# Altium schematic sheet Charging.SchDoc
size A; SheetNumber: 6
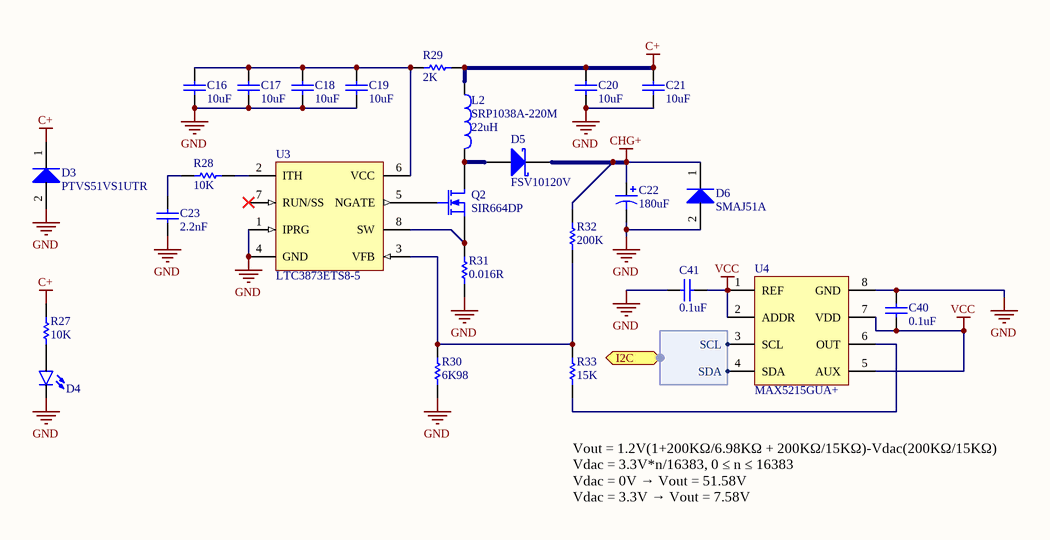
[diagram p0: Charging.SchDoc]

## Parts
C16  value 10uF  [C0603[1608X92]]  (hidden comment: 10uF 35V 0603)
C17  value 10uF  [C0603[1608X92]]  (hidden comment: 10uF 35V 0603)
C18  value 10uF  [C0603[1608X92]]  (hidden comment: 10uF 35V 0603)
C19  value 10uF  [C0603[1608X92]]  (hidden comment: 10uF 35V 0603)
C20  value 10uF  [C1206[3216X160]]  (hidden comment: 10uF 50V 1206)
C21  value 10uF  [C1206[3216X160]]  (hidden comment: 10uF 50V 1206)
C22  value 180uF  [CAP-ELECTROLYTIC[10.0x12.6]]  (hidden comment: 180uF 50V)
C23  value 2.2nF  [C0402[1005X55]]  (hidden comment: 2.2nF 50V 0402)
C40  value 0.1uF  [C0402[1005X55]]  (hidden comment: 0.1uF 6.3V 0402)
C41  value 0.1uF  [C0402[1005X55]]  (hidden comment: 0.1uF 6.3V 0402)
D3  PTVS51VS1UTR  [SOD-123W]
D4  LED_0603_GREEN_5mA  [LED0603]  (value not drawn)
D5  FSV10120V  [TO-277]
D6  SMAJ51A  [DO-214AC]
L2  SRP1038A-220M  value 22uH  [SRP1038A]
Q2  SIR664DP  [PowerPak-8]
R27  value 10K  [R0603[1608]]  (hidden comment: 10K 1% 0603)
R28  value 10K  [R0402[1005]]  (hidden comment: 10K 1% 0402)
R29  value 2K  [R0603[1608]]  (hidden comment: 2K 2% 0603)
R30  value 6K98  [R0402[1005]]  (hidden comment: 6K98 1% 0402)
R31  value 0.016R  [R1206[3216]]  (hidden comment: 0.016R 1% 1206)
R32  value 200K  [R0402[1005]]  (hidden comment: 200K 1% 0402)
R33  value 15K  [R0402[1005]]  (hidden comment: 15K 1% 0402)
U3  LTC3873ETS8-5  [SOT-23-8]
U4  MAX5215GUA+  [MSOP-8]

## Ports
I2C (harness I2C)

## Harnesses
I2C: SCL, SDA

## Nets
C+: C20.2 C21.2 D3.1(K) L2.1 R27.2 R29.2
CHG+: C22.1 D5.1(K) D6.1(K) R32.2
GND: C16.1 C17.1 C18.1 C19.1 C20.1 C21.1 C22.2 C23.1 C40.1 C41.1 D3.2(A) D4.C D6.2(A) R30.1 R31.1 U3.1(IPRG) U3.4(GND) U4.8(GND)
VCC: C40.2 C41.2 U4.1(REF) U4.2(ADDR) U4.5(AUX) U4.7(VDD)
NetC16_2: C16.2 C17.2 C18.2 C19.2 R29.1 U3.6(VCC)
NetC23_2: C23.2 R28.2
NetD4_A: D4.A R27.1
NetD5_2: D5.2(A) L2.2 Q2.3(D)
NetQ2_1: Q2.1(S) R31.2 U3.8(SW)
NetQ2_2: Q2.2(G) U3.5(NGATE)
NetR28_1: R28.1 U3.2(ITH)
NetR30_2: R30.2 R32.1 R33.2 U3.3(VFB)
NetR33_1: R33.1 U4.6(OUT)
NetU4_3: U4.3(SCL) ; port I2C.SCL
NetU4_4: U4.4(SDA) ; port I2C.SDA

Not connected (* = marked no-connect by the designer): U3 7(RUN/SS)*

## Notes on the sheet
- Vout = 1.2V(1+200KΩ/6.98KΩ + 200KΩ/15KΩ)-Vdac(200KΩ/15KΩ)
  Vdac = 3.3V*n/16383, 0 ≤ n ≤ 16383
  Vdac = 0V → Vout = 51.58V
  Vdac = 3.3V → Vout = 7.58V

## Library data of the parts
C16-C19 = CAP_10uF_35V_0603_10%: 10uF 35V 10% 0603 (1608 Metric); PartNumber: GRM188R6YA106MA73D; Manufacturer: Murata; Mounting Technology: Surface Mount; PackageReference: 0603; PackageDescription: 0603 (1608 Metric); Voltage: 35V; Tolerance: 10%
C20 C21 = CAP_10uF_50V_1206_20%: 10uF 50V 20% 1206 (3216 Metric); PartNumber: UMK316BBJ106ML-T; Manufacturer: Taiyo Yuden; Tolerance: 20%; Mounting Technology: Surface Mount; PackageReference: 1206; PackageDescription: 1206 (3216 Metric); Voltage: 50V
C22 = CAP_180uF_50V_20%: 180uF 50V 20%; PartNumber: PCR1H181MCL1GS; Manufacturer: Nichicon; PackageReference: 1H; PackageDescription: 10x12.7mm; Mounting Technology: Surface Mount; Voltage: 50V; Tolerance: 20%
C23 = CAP_2.2nF_50V_0402_10%: 2.2nF 50V 10% 0402 (1005 Metric); PartNumber: GCM155R71H222KA37D; Manufacturer: Murata; Tolerance: 10%; Mounting Technology: Surface Mount; PackageReference: 0402; PackageDescription: 0402 (1005 Metric); Voltage: 50V
C40 C41 = CAP_0.1uF_6.3V_0402_10%: 0.1uF 6.3V 10% 0402 (1005 Metric); PartNumber: GRM155R70J104KA01D; Manufacturer: Murata; Mounting Technology: Surface Mount; PackageReference: 0402; PackageDescription: 0402 (1005 Metric); Voltage: 6.3V; Tolerance: 10%
D3 = PTVS51VS1UTR,115: Manufacturer: NXP; Mounting Technology: Surface Mount; PartNumber: PTVS51VS1UTR,115; PackageReference: SOD-123W; PackageDescription: SOD123W, 2-Leads
D4 = LED_0603_GREEN_5mA: PartNumber: LTST-C193TGKT-5A; Manufacturer: Lite-On Inc.; PackageReference: 0603; PackageDescription: 0603 (1608 Metric); Mounting Technology: Surface Mount
D5 = FSV10120V: Schottky Diodes & Rectifiers 10 Amp 120V Schottky Rectifier; Manufacturer: Fairchild Semiconductor; PackageReference: TO-277-3; PartNumber: FSV10120V; Mounting Technology: Surface Mount
D6 = SMAJ51A-E3/61: Manufacturer: Vishay; PartNumber: SMAJ51A-E3/61; PackageReference: DO-214AC; PackageDescription: DO-214AC, 2 Leads; Mounting Technology: Surface Mount
L2 = SRP1038A-220M: 22uH 20% 7A 1038; Manufacturer: Bourns; PackageReference: SRP1038A; PartNumber: SRP1038A-220M; Mounting Technology: Surface Mount
Q2 = SIR664DP-T1-GE3: N-Channel MOSFET; Manufacturer: Vishay; PartNumber: SIR664DP-T1-GE3; Mounting Technology: Surface Mount; PackageReference: PowerPAK-8
R27 = RES_10K_0603_1%: 10K 0.25W 1% 0603 (1005 Metric); Manufacturer: Vishay; PartNumber: RCS060310K0FKEA; Power: 0.25W; Tolerance: 1%; Mounting Technology: Surface Mount; PackageReference: 0603; PackageDescription: 0603 (1608 Metric); ComponentLink1Description: Datasheet; ComponentLink1URL: http://www.vishay.com/docs/20065/rcse3.pdf
R28 = RES_10K_0402_1%: 10K 0.063W 1% 0402 (1005 Metric); Manufacturer: KOA Speer; PartNumber: RK73H1ETTP1002F; Tolerance: 1%; Power: 0.063W; Mounting Technology: Surface Mount; PackageReference: 0402; PackageDescription: 0402 (1005 Metric); ComponentLink1Description: Datasheet; ComponentLink1URL: http://www.koaspeer.com/catimages/Products/RK73H/RK73H.pdf
R29 = RES_2K_0603_2%: 2K 1.5W 2% 0603 (1005 Metric); Manufacturer: Vishay; PartNumber: RCP0603W2K00GEB; Tolerance: 2%; Power: 1.5W; Mounting Technology: Surface Mount; PackageReference: 0603; PackageDescription: 0603 (1608 Metric); ComponentLink1Description: Datasheet; ComponentLink1URL: http://www.vishay.com/docs/20043/crcwhpe3.pdf
R30 = RES_6K98_0402_1%: 6K98 0.063W 1% 0402 (1005 Metric); Manufacturer: KOA Speer; PartNumber: RK73H1ETTP6981F; Power: 0.063W; Tolerance: 1%; Mounting Technology: Surface Mount; PackageReference: 0402; PackageDescription: 0402 (1005 Metric); ComponentLink1Description: Datasheet; ComponentLink1URL: http://www.koaspeer.com/catimages/Products/RK73H/RK73H.pdf
R31 = RES_0.016R_1206_1%: 0.016R 1W 1% 1206 (3216 Metric); Manufacturer: Panasonic; PartNumber: ERJ-8CWFR016V; Power: 1W; Tolerance: 1%; Mounting Technology: Surface Mount; PackageReference: 1206; PackageDescription: 1206 (3216 Metric); ComponentLink1Description: Datasheet; ComponentLink1URL: https://industrial.panasonic.com/cdbs/www-data/pdf/RDA0000/AOA0000C239.pdf
R32 = RES_200K_0402_1%: 200K 0.063W 1% 0402 (1005 Metric); Manufacturer: KOA Speer; PartNumber: RK73H1ETTP2003F; Power: 0.063W; Tolerance: 1%; Mounting Technology: Surface Mount; PackageReference: 0402; PackageDescription: 0402 (1005 Metric); ComponentLink1Description: Datasheet; ComponentLink1URL: http://www.koaspeer.com/catimages/Products/RK73H/RK73H.pdf
R33 = RES_15K_0402_1%: 15K 0.063W 1% 0402 (1005 Metric); Manufacturer: KOA Speer; PartNumber: RK73H1ETTP1502F; Tolerance: 1%; Power: 0.063W; Mounting Technology: Surface Mount; PackageReference: 0402; PackageDescription: 0402 (1005 Metric); ComponentLink1Description: Datasheet; ComponentLink1URL: http://www.koaspeer.com/catimages/Products/RK73H/RK73H.pdf
U3 = LTC3873ETS8: PartNumber: LTC3873ETS8-5#PBF; Manufacturer: Linear Technology; PackageReference: TSOT-23-8; Mounting Technology: Surface Mount
U4 = MAX5215GUA+: 14 Bit Digital to Analog Converter; Manufacturer: Maxim Integrated; PartNumber: MAX5215GUA+; Mounting Technology: Surface Mount; PackageReference: MSOP-8